# Altium schematic sheet Lowpass Amplifier.SchDoc
size A; SheetNumber: 7; SheetTotal: 7
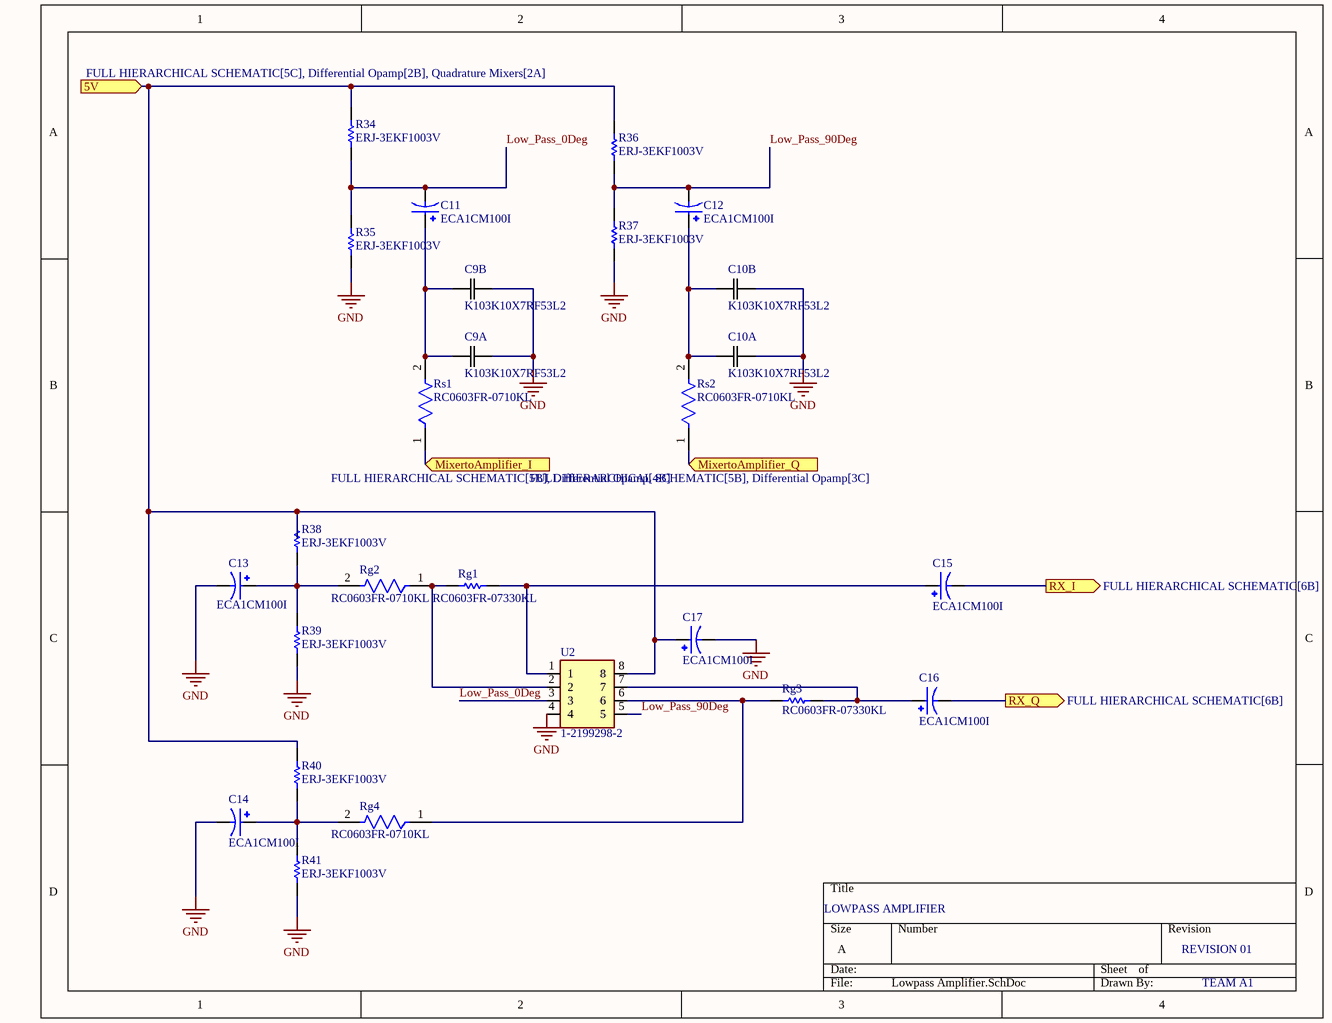
[diagram p0: Lowpass Amplifier.SchDoc]

## Parts
C9A  K103K10X7RF53L2  [K103K10X7RF53L2_VIS]
C9B  K103K10X7RF53L2  [K103K10X7RF53L2_VIS]
C10A  K103K10X7RF53L2  [K103K10X7RF53L2_VIS]
C10B  K103K10X7RF53L2  [K103K10X7RF53L2_VIS]
C11  ECA1CM100I  [CAPPRD250W50D500H1100]
C12  ECA1CM100I  [CAPPRD250W50D500H1100]
C13  ECA1CM100I  [CAPPRD250W50D500H1100]
C14  ECA1CM100I  [CAPPRD250W50D500H1100]
C15  ECA1CM100I  [CAPPRD250W50D500H1100]
C16  ECA1CM100I  [CAPPRD250W50D500H1100]
C17  ECA1CM100I  [CAPPRD250W50D500H1100]
R34  ERJ-3EKF1003V  [RESC1608X55X30ML15T15]
R35  ERJ-3EKF1003V  [RESC1608X55X30ML15T15]
R36  ERJ-3EKF1003V  [RESC1608X55X30ML15T15]
R37  ERJ-3EKF1003V  [RESC1608X55X30ML15T15]
R38  ERJ-3EKF1003V  [RESC1608X55X30ML15T15]
R39  ERJ-3EKF1003V  [RESC1608X55X30ML15T15]
R40  ERJ-3EKF1003V  [RESC1608X55X30ML15T15]
R41  ERJ-3EKF1003V  [RESC1608X55X30ML15T15]
Rg1  RC0603FR-07330KL  [RESC0603(1608)_M]
Rg2  RC0603FR-0710KL  [FP-RC0603-0_55-IPC_C]
Rg3  RC0603FR-07330KL  [RESC0603(1608)_M]
Rg4  RC0603FR-0710KL  [FP-RC0603-0_55-IPC_C]
Rs1  RC0603FR-0710KL  [FP-RC0603-0_55-IPC_C]
Rs2  RC0603FR-0710KL  [FP-RC0603-0_55-IPC_C]
U2  1-2199298-2  [TE_1-2199298-2]

## Ports
5V (in, see FULL HIERARCHICAL SCHEMATIC[5C], Differential Opamp[2B], Quadrature Mixers[2A]), MixertoAmplifier_I (in, see FULL HIERARCHICAL SCHEMATIC[5B], Differential Opamp[4B]), MixertoAmplifier_Q (in, see FULL HIERARCHICAL SCHEMATIC[5B], Differential Opamp[3C]), RX_I (out, see FULL HIERARCHICAL SCHEMATIC[6B]), RX_Q (out, see FULL HIERARCHICAL SCHEMATIC[6B])

## Nets
GND: C9A.2 C9B.2 C10A.2 C10B.2 C13.N C14.N C17.N R35.1 R37.1 R39.1 R41.1 U2.4
5V: C17.P R34.2 R36.2 R38.2 R40.2 U2.8 ; port 5V
Low_Pass_0Deg: C11.N R34.1 R35.2 U2.3
Low_Pass_90Deg: C12.N R36.1 R37.2 U2.5
MixertoAmplifier_I: Rs1.1 ; port MixertoAmplifier_I
MixertoAmplifier_Q: Rs2.1 ; port MixertoAmplifier_Q
RX_I: C15.N ; port RX_I
RX_Q: C16.N ; port RX_Q
NetC9A_1: C9A.1 C9B.1 C11.P Rs1.2
NetC10A_1: C10A.1 C10B.1 C12.P Rs2.2
NetC13_P: C13.P R38.1 R39.2 Rg2.2
NetC14_P: C14.P R40.1 R41.2 Rg4.2
NetC15_P: C15.P Rg1.2 U2.1
NetC16_P: C16.P Rg3.2 U2.7
NetRg1_1: Rg1.1 Rg2.1 U2.2
NetRg3_1: Rg3.1 Rg4.1 U2.6

## Notes on the sheet
- LOWPASS AMPLIFIER
- REVISION 01
- TEAM A1

## Library data of the parts
C9A C9B C10A C10B = K103K10X7RF53L2: No Description Available; Mfr_Name: Vishay; Type: Ceramic Capacitor
C11-C17 = ECA1CM100I: 10ÂµF 16V Aluminum Electrolytic Capacitors Radial, Can 2000 Hrs @ 85Â°C; MF: Panasonic; SnapEDA_Link: https://www.snapeda.com/parts/ECA1CM100I/Panasonic/view-part/?ref=snap; Check_prices: https://www.snapeda.com/parts/ECA1CM100I/Panasonic/view-part/?ref=eda; MP: ECA1CM100I; Digi-Key_Part_Number: P19513TB-ND; Package: RADIAL-2 Panasonic; Value: *
R34-R41 = CMP-2000-00182-1: Manufacturer: Panasonic; Part Number: ERJ-3EKF1003V
Rg1 Rg3 = CMP-1012-00793-1: 330K 0.1W 1% 0603 (1608 Metric)  SMD; Case-EIA: 0603; Case-Metric: 1608; Value: 330000.00 Ohm; Power: 0.1 W; Technology: SMT; Tolerance: 1 %
Rg2 Rg4 Rs1 Rs2 = CMP-2100-03664-2: RES 10K OHM 1% 1/10W 0603; Voltage Rating: 75V; Voltage Rating (DC): 50V; Resistance: 10kR; Power Rating: 100mW; Temperature Coefficient: 100ppm/°C; Depth: 0.8mm; Termination: SMD/SMT; Resistor Type: Thick Film; Series: RC; Construction: Rectangular; Features: Moisture Resistant; Packaging: Tape and Reel; Min Operating Temperature: -55°C; Number of Terminations: 2; Lead Pitch: 0.3mm; RoHS Compliant: Yes; Case/Package: 0603; Resistance Tolerance: 1%; Military Standard: Not; Weight: 7.1E-05oz; Number of Pins: 2; Tolerance: 1%; Length: 1.6mm; Case Code (Imperial): 0603; Lead Free: Lead Free; Width: 0.8mm; Max Power Dissipation: 100mW; Height: 0.45mm; Max Operating Temperature: 155°C; Case Code (Metric): 1608; Size Code: 0603
U2 = 1-2199298-2: 8 _2 x 4_ Pos DIP, 0.3 _7.62mm_ Row Spacing Socket Tin Through Hole; MF: TE Connectivity; SnapEDA_Link: https://www.snapeda.com/parts/1-2199298-2/TE%20Connectivity%20AMP%20Connectors/view-part/2761758/?ref=snap; Value: *; TE_purchase_URL: https://www.te.com/usa-en/product-1-2199298-2.html?te_bu=Cor&te_type=disp&te_campaign=seda_glo_cor-seda-global-disp-prtnr-fy19-seda-model-bom-cta_sma-317_1&elqCampaignId=32493; Price: None; Availability: Unavailable; MP: 1-2199298-2; Package: None